# EAGLE schematic 472kHz-Transverter (EAGLE 9.6.2)
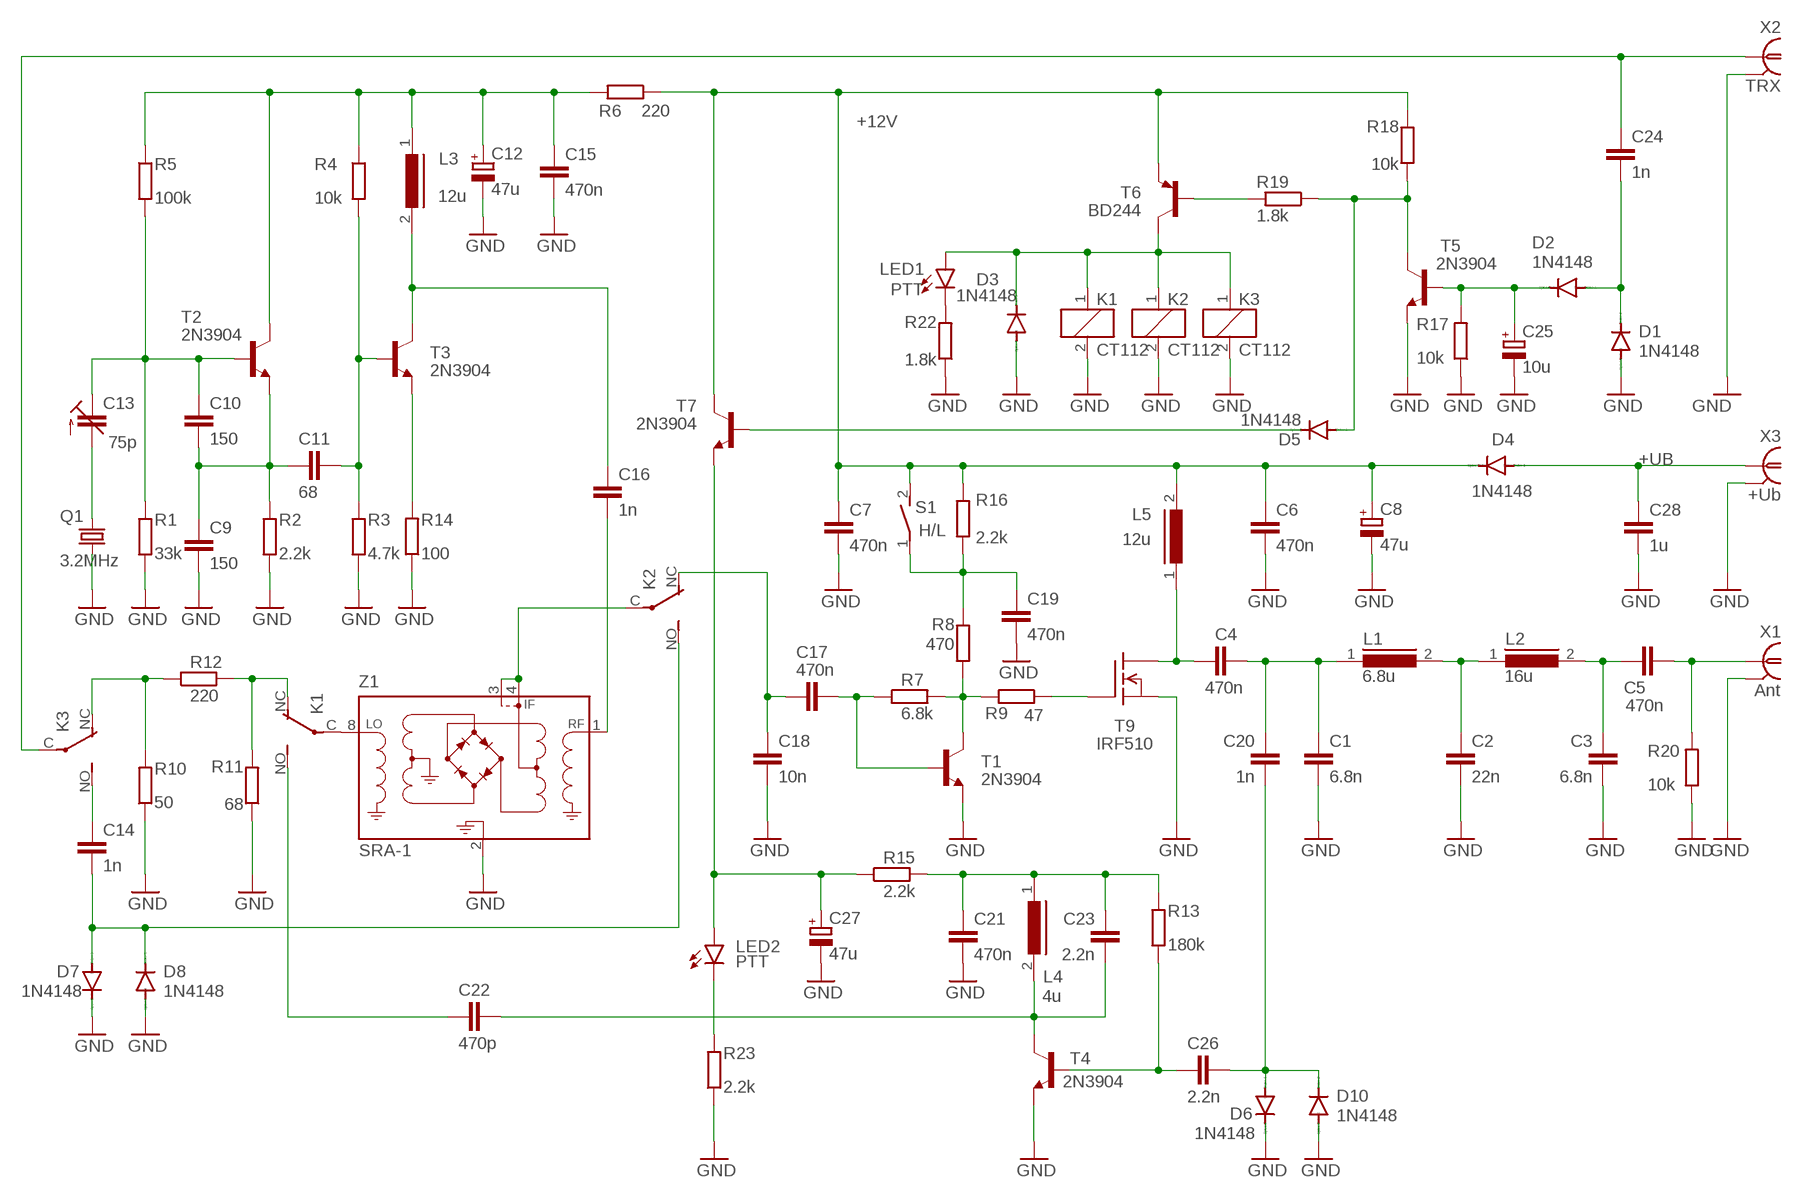
[diagram p0: schematic, sheet 1]

## Parts
C1  6.8n  C5/2.5  [C5B2.5]
C2  22n  C5/2.5  [C5B2.5]
C3  6.8n  C5/2.5  [C5B2.5]
C4  470n  C5/2.5  [C5B2.5]
C5  470n  C5/2.5  [C5B2.5]
C6  470n  C5/2.5  [C5B2.5]
C7  470n  C5/2.5  [C5B2.5]
C8  47u  CPOL-EUCT7343  [CT7343]
C9  150  C5/2.5  [C5B2.5]
C10  150  C5/2.5  [C5B2.5]
C11  68  C5/2.5  [C5B2.5]
C12  47u  CPOL-EUCT7343  [CT7343]
C13  75p  C-TRIMM808-1  [CTRIM808-1]
C14  1n  C5/2.5  [C5B2.5]
C15  470n  C5/2.5  [C5B2.5]
C16  1n  C5/2.5  [C5B2.5]
C17  470n  C5/2.5  [C5B2.5]
C18  10n  C5/2.5  [C5B2.5]
C19  470n  C5/2.5  [C5B2.5]
C20  1n  C5/2.5  [C5B2.5]
C21  470n  C5/2.5  [C5B2.5]
C22  470p  C5/2.5  [C5B2.5]
C23  2.2n  C5/2.5  [C5B2.5]
C24  1n  C5/2.5  [C5B2.5]
C25  10u  CPOL-EUCT7343  [CT7343]
C26  2.2n  C5/2.5  [C5B2.5]
C27  47u  CPOL-EUCT7343  [CT7343]
C28  1u  C5/2.5  [C5B2.5]
D1  1N4148  1N4148DO35-7  [DO35-7]
D2  1N4148  1N4148DO35-7  [DO35-7]
D3  1N4148  1N4148DO35-7  [DO35-7]
D4  1N4148  1N4148DO35-7  [DO35-7]
D5  1N4148  1N4148DO35-7  [DO35-7]
D6  1N4148  1N4148DO35-7  [DO35-7]
D7  1N4148  1N4148DO35-7  [DO35-7]
D8  1N4148  1N4148DO35-7  [DO35-7]
D10  1N4148  1N4148DO35-7  [DO35-7]
K1  CT112  [CT-SLIM]
K2  CT112  [CT-SLIM]
K3  CT112  [CT-SLIM]
L1  6.8u  ED22  [ED22]
L2  16u  ED22  [ED22]
L3  12u  ED22  [ED22]
L4  4u  ED22  [ED22]
L5  12u  ED22  [ED22]
LED1  PTT  LAW57B  [W57B]
LED2  PTT  LAW57B  [W57B]
Q1  3.2MHz  KX-KS  [11.4X4.5]
R1  33k  R-EU_0207/5V  [0207/5V]
R2  2.2k  R-EU_0207/5V  [0207/5V]
R3  4.7k  R-EU_0207/5V  [0207/5V]
R4  10k  R-EU_0207/5V  [0207/5V]
R5  100k  R-EU_0207/5V  [0207/5V]
R6  220  R-EU_0207/5V  [0207/5V]
R7  6.8k  R-EU_0207/5V  [0207/5V]
R8  470  R-EU_0207/5V  [0207/5V]
R9  47  R-EU_0207/5V  [0207/5V]
R10  50  R-EU_0207/5V  [0207/5V]
R11  68  R-EU_0207/5V  [0207/5V]
R12  220  R-EU_0207/5V  [0207/5V]
R13  180k  R-EU_0207/5V  [0207/5V]
R14  100  R-EU_0207/5V  [0207/5V]
R15  2.2k  R-EU_0207/5V  [0207/5V]
R16  2.2k  R-EU_0207/5V  [0207/5V]
R17  10k  R-EU_0207/5V  [0207/5V]
R18  10k  R-EU_0207/5V  [0207/5V]
R19  1.8k  R-EU_0207/5V  [0207/5V]
R20  10k  R-EU_0207/5V  [0207/5V]
R22  1.8k  R-EU_0207/5V  [0207/5V]
R23  2.2k  R-EU_0207/5V  [0207/5V]
S1  H/L  DS01E  [DS-01]
T1  2N3904  [TO92]
T2  2N3904  [TO92]
T3  2N3904  [TO92]
T4  2N3904  [TO92]
T5  2N3904  [TO92]
T6  BD244  [TO220]
T7  2N3904  [TO92]
T9  IRF510  [TO220]
X1  Ant  R141426  [R141426]
X2  TRX  R141426  [R141426]
X3  +Ub  R141426  [R141426]
Z1  SRA-1  [A01]

## Nets
+12V: C6.1 C7.1 C8.+ D4.C L5.2 R6.1 R16.2 R18.2 S1.2 T6.3(E) T7.1(C)
+UB: C28.1 D4.A X3.1
GND: C1.2 C2.2 C3.2 C6.2 C7.2 C8.- C9.2 C12.- C15.2 C18.2 C19.2 C21.2 C25.- C27.- C28.2 D1.A D3.A D6.C D7.C D8.A D10.A K1.2 K2.2 K3.2 Q1.2 R1.2 R2.2 R3.2 R10.1 R11.1 R14.1 R17.1 R20.1 R22.1 R23.1 T1.3(E) T4.3(E) T5.3(E) T9.3(S) X1.2 X1.3 X1.4 X1.5 X2.2 X2.3 X2.4 X2.5 X3.2 X3.3 X3.4 X3.5 Z1.2(CASEGROUND)
N$1: C14.1 K3.NO(2:S)
N$2: C2.1 L1.2 L2.1
N$3: C3.1 C5.1 L2.2
N$4: R7.2 R8.1 R9.2 T1.1(C)
N$5: C5.2 R20.2 X1.1
N$6: C1.1 C4.2 C20.2 L1.1
N$7: C4.1 L5.1 T9.2(D)
N$8: R9.1 T9.1(G)
N$9: C17.2 R7.1 T1.2(B)
N$10: D5.A R18.1 R19.1 T5.1(C)
N$11: C13.2(A) Q1.1
N$12: R14.2 T3.3(E)
N$13: C10.1 C13.1(E) R1.1 R5.2 T2.2(B)
N$14: C9.1 C10.2 C11.1 R2.1 T2.3(E)
N$15: C12.+ C15.1 L3.1 R4.1 R5.1 R6.2 T2.1(C)
N$16: C16.1 L3.2 T3.1(C)
N$17: C11.2 R3.1 R4.2 T3.2(B)
N$18: K1.C(2:P) Z1.8(L)
N$19: C16.2 Z1.1(R)
N$20: K2.C(2:P) Z1.3(IF) Z1.4(IF)
N$21: C17.1 C18.1 K2.NC(2:O)
N$22: K1.NC(2:O) R11.2 R12.2
N$23: C19.1 R8.2 R16.1 S1.1
N$24: K3.NC(2:O) R10.2 R12.1
N$25: C24.1 K3.C(2:P) X2.1
N$26: C22.1 K1.NO(2:S)
N$27: C21.1 C23.2 L4.1 R13.2 R15.2
N$28: C20.1 C26.1 D6.A D10.C
N$29: D3.C K1.1 K2.1 K3.1 LED1.A T6.2(C)
N$30: C14.2 D7.A D8.C K2.NO(2:S)
N$31: D5.C T7.2(B)
N$32: C27.+ LED2.A R15.1 T7.3(E)
N$34: C22.2 C23.1 L4.2 T4.1(C)
N$36: C24.2 D1.C D2.A
N$37: C25.+ D2.C R17.2 T5.2(B)
N$39: R19.2 T6.1(B)
N$40: C26.2 R13.1 T4.2(B)
N$43: LED1.C LED1.C@1(C) LED1.C@2(C) LED1.C@3(C) LED1.C@4(C) LED1.C@5(C) R22.2
N$44: LED2.C LED2.C@1(C) LED2.C@2(C) LED2.C@3(C) LED2.C@4(C) LED2.C@5(C) R23.2

## Power pins joined to a net without a drawn wire
GND: Z1.5(GND) Z1.6(GND) Z1.7(GND)

## Library data of the parts
C1-C7 C9-C11 C14-C24 C26 C28 = capacitor-wima:C: CAPACITOR naming: grid - package width
C8 C12 C25 C27 = rcl:CPOL-EU: POLARIZED CAPACITOR, European symbol; SPICEPREFIX: C
C13 = rcl:C-TRIMM: Trimm capacitor; SPICEPREFIX: C
D1-D8 D10 = diode:1N4148: DIODE high speed (Philips)
K1-K3 = relay:CT112: ULTRA SMALL AUTOMOTIVE RELAY NAiS Slim 1c type en_ds_61205_0000.pdf; OC_FARNELL: unknown; OC_NEWARK: unknown
L1-L5 = inductors:ED22: INDUCTOR; SPICEPREFIX: L
LED1 LED2 = led:*W57B: Golden Dragon® 1 Watt LED Place heat sink pads of cathode with INVOKE Source: www.osram-os.com la_ly_w57b.pdf
Q1 = crystal-geyer_V1_0:KX: Quartz Crystals (MHz) SMD: KX - Serie Model Size l/w/h [mm] Frequency Range Frequency Stability Temp. Range [°C] Load Capacitance AECQ 200 availabel Datasheet KX-4 KX-5 KX-6 KX-7 KX-9A KX-9B KX-12A KX-12B KX-13 KX-20 KX-K KX-KS 1.6/1.2/0.3 2.0/1.6/0.45 2.5/2.0/0.55 3.2/2.5/0.8 5.0/3.2/1.0 5.0/3.2/1.1 6.0/3.5/1.1 6.0/3.5/1.0 7.0/5.0 /1.3 11.6/5.5/1.6 12.3/4.5/4.2 12.3/4.5/3.2 24.0 ~ 80.0 MHz 16.0 ~ 80.0 MHz 12.0 ~ 80.0 MHz 8.0 ~ 60.0 MHz 7,68 ~ 300,0 MHz 8,0 ~ 50,0 MHz 8,0 ~ 150,0 MHz 8,0 ~ 50,0 MHz 6,0 ~ 160,0 MHz 3,579 ~ 25,0 MHz 3,579 ~ 70,0 MHz 3,579 ~ 70,0 MHz ±10 … ±50ppm ±10 … ±50ppm ±10 … ±50ppm ±10 … ±50ppm ±10 … ±50ppm ±10 … ±50ppm ±10 … ±50ppm ±10 … ±50ppm ±10 … ±50ppm ±50ppm ±10 … ±50ppm ±10 … ±50ppm (*) -40°C …+85°C (*) -40°C …+125°C (*) -40°C …+125°C (*) -40°C …+125°C (*) -40°C …+105°C (*) -40°C …+105°C (*) -40°C …+125°C (*) -40°C …+105°C (*) -40°C …+105°C (*) -40°C …+105°C (*) -40°C …+85°C (*) -40°C …+85°C 8, 8…16 8, 8…16 10, 8…16 12, 7…20 16, 10…20 16, 10…20 16, 10…20 16, 12…20 16, 12…20 16, 12…20 16, 12…30 16, 12…30 - yes yes yes - - - - - - - - KX-4.pdf <http://www.geyer-electronic.de/uploads/tx_userartikelfrequenz/GEYER-KX-4.pdf> KX-5.pdf <http://www.geyer-electronic.de/uploads/tx_userartikelfrequenz/GEYER-KX-5.pdf> KX-6.pdf <http://www.geyer-electronic.de/uploads/tx_userartikelfrequenz/GEYER-KX-6.pdf> KX-7.pdf <http://www.geyer-electronic.de/uploads/tx_userartikelfrequenz/GEYER-KX-7.pdf> KX-9A.pdf <http://www.geyer-electronic.de/uploads/tx_userartikelfrequenz/GEYER-KX-9A.pdf> KX-9B.pdf <http://www.geyer-electronic.de/uploads/tx_userartikelfrequenz/GEYER-KX-9B.pdf> KX-12A.pdf <http://www.geyer-electronic.de/uploads/tx_userartikelfrequenz/GEYER-KX-12A.pdf> KX-12B.pdf <http://www.geyer-electronic.de/uploads/tx_userartikelfrequenz/GEYER-KX-12B.pdf> KX-13.pdf <http://www.geyer-electronic.de/uploads/tx_userartikelfrequenz/GEYER-KX-13.pdf> KX-20.pdf <http://www.geyer-electronic.de/uploads/tx_userartikelfrequenz/GEYER-KX-20.pdf> KX-K.pdf <http://www.geyer-electronic.de/uploads/tx_userartikelfrequenz/GEYER-KX-K.pdf> KX-KS.pdf <http://www.geyer-electronic.de/uploads/tx_userartikelfrequenz/GEYER-KX-KS.pdf> <http://www.geyer-electronic.de/fileadmin/template/img/logo-geyer-electronic.png> Details see: http://www.geyer-electronic.de/Frequenz-Produkte.9.0.html Created 2016-06-07, Hans Locher 2016 (C) Geyer Quartz Technology KX4,KX5,KX6,KX7,KX9A,KX9B,KX12A,KX12B,KX13,KX20,KXK,KXKS;1612;2016;2520;3225;5032;6035;7050;11655;12345;1,6x1,2;2,0x1,6;2,5x2,0;3,2x2,5;5,0x3,2;6,0x3,5;7,0x5,0;11,6x5,5;12,3x4,5;12,3x4,5;1.6x1.2;2.0x1.6;2.5x2.0;3.2x2.5;5.0x3.2;6.0x3.5;7.0x5.0;11.6x5.5;12.3x4.5;12.3x4.5;
R1-R20 R22 R23 = rcl:R-EU_: RESISTOR, European symbol; SPICEPREFIX: R
S1 = switch-dil:DS01E: DIL/CODE SWITCH; OC_FARNELL: unknown; OC_NEWARK: unknown
T1-T5 T7 = transistor:2N3904: NPN TRANSISTOR
T6 = transistor:BD244: PNP TRANSISTOR Source: Motorola Semiconductor, Master Selection Guide Q3/95 SG73 REV 8 page 5.5-5
T9 = transistor-fet:IRF510: N-Channel Enhancement MOSFET (HEXFET); 100V; 5,6A; 0,54Ohm
X1-X3 = con-coax:R141426: BNC COAX CONNECTOR Radiall 50/75 Ohm Spoerle; MF: FARNELL; MPN: R141426161; OC_FARNELL: 4195115; OC_NEWARK: 14J7919
Z1 = minicircuits:SRA-1: Frequency Mixer Level 7 (LO Power + 7 dBm) Source: minicircuits.com .. SRA-1+.pdf; OC_FARNELL: unknown; OC_NEWARK: unknown